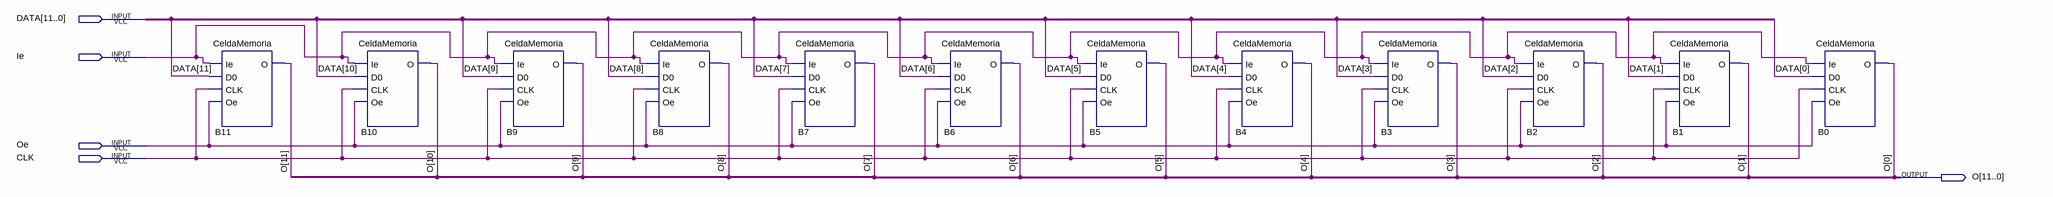
[diagram p0: schematic sheet]
// Quartus schematic Registro12.bdf as structural Verilog: 12 symbols, 5 pins
module Registro12 (
  input  [11:0] DATA,
  input  Ie,
  input  Oe,
  input  CLK,
  output [11:0] O
);

  CeldaMemoria B11 (.Ie(Ie), .D0(DATA[11]), .CLK(CLK), .Oe(Oe), .O(O[11]));
  CeldaMemoria B10 (.Ie(Ie), .D0(DATA[10]), .CLK(CLK), .Oe(Oe), .O(O[10]));
  CeldaMemoria B9 (.Ie(Ie), .D0(DATA[9]), .CLK(CLK), .Oe(Oe), .O(O[9]));
  CeldaMemoria B8 (.Ie(Ie), .D0(DATA[8]), .CLK(CLK), .Oe(Oe), .O(O[8]));
  CeldaMemoria B7 (.Ie(Ie), .D0(DATA[7]), .CLK(CLK), .Oe(Oe), .O(O[7]));
  CeldaMemoria B6 (.Ie(Ie), .D0(DATA[6]), .CLK(CLK), .Oe(Oe), .O(O[6]));
  CeldaMemoria B5 (.Ie(Ie), .D0(DATA[5]), .CLK(CLK), .Oe(Oe), .O(O[5]));
  CeldaMemoria B4 (.Ie(Ie), .D0(DATA[4]), .CLK(CLK), .Oe(Oe), .O(O[4]));
  CeldaMemoria B3 (.Ie(Ie), .D0(DATA[3]), .CLK(CLK), .Oe(Oe), .O(O[3]));
  CeldaMemoria B2 (.Ie(Ie), .D0(DATA[2]), .CLK(CLK), .Oe(Oe), .O(O[2]));
  CeldaMemoria B1 (.Ie(Ie), .D0(DATA[1]), .CLK(CLK), .Oe(Oe), .O(O[1]));
  CeldaMemoria B0 (.Ie(Ie), .D0(DATA[0]), .CLK(CLK), .Oe(Oe), .O(O[0]));
endmodule
